# EAGLE design version10_25 (EAGLE 7.1.0)
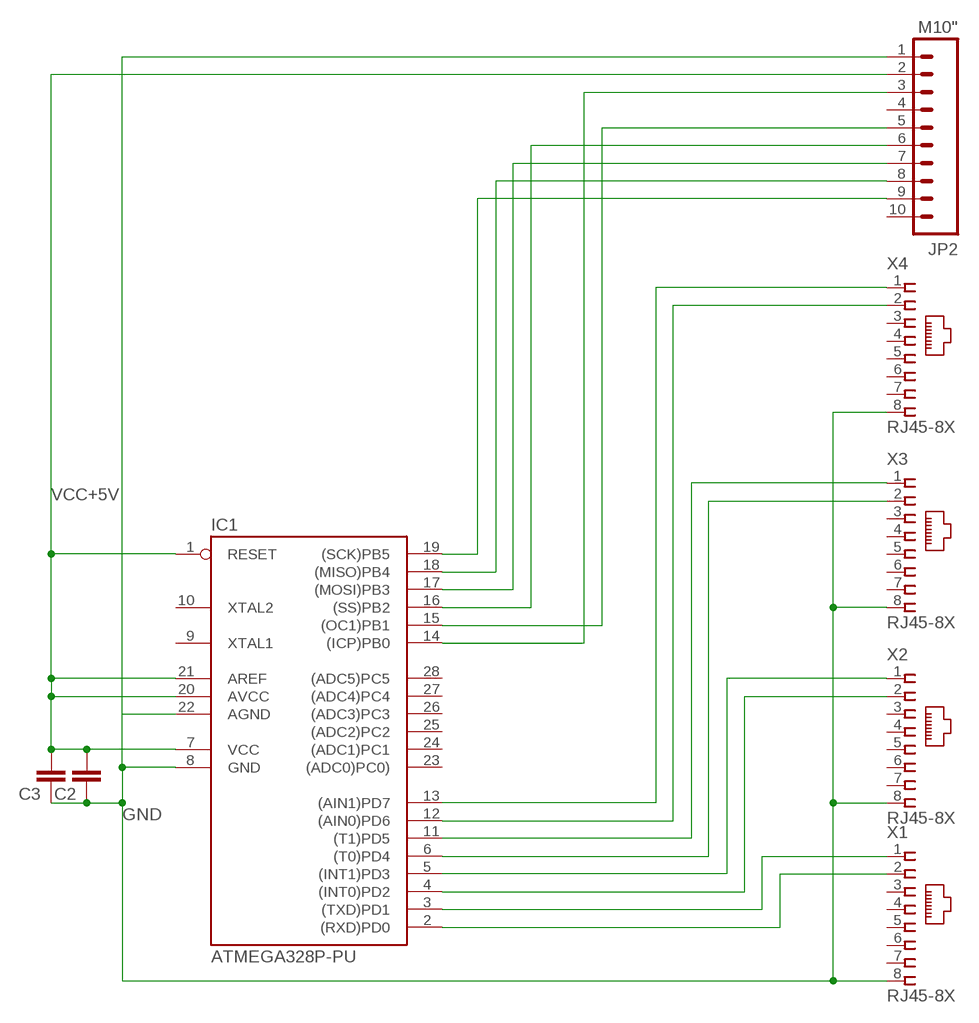
[diagram p0: schematic, sheet 1]

## Parts
C2  CAP1206  [1206]
C3  CAP1206  [1206]
IC1  ATMEGA328P-PU  [DIL28-3]
JP2  M10"  [1X10]
X1  RJ45-8X  [RJ45-NO-SHIELD]
X2  RJ45-8X  [RJ45-NO-SHIELD]
X3  RJ45-8X  [RJ45-NO-SHIELD]
X4  RJ45-8X  [RJ45-NO-SHIELD]

## Nets
GND: C2.1 C3.1 IC1.8(GND) IC1.22(AGND) JP2.1 X1.8 X2.8 X3.8 X4.8
N$1: IC1.19((SCK)PB5) JP2.9
N$2: IC1.18((MISO)PB4) JP2.8
N$3: IC1.15((OC1)PB1) JP2.5
N$4: IC1.17((MOSI)PB3) JP2.7
N$5: IC1.16((SS)PB2) JP2.6
N$6: IC1.14((ICP)PB0) JP2.3
N$7: IC1.2((RXD)PD0) X1.2
N$8: IC1.3((TXD)PD1) X1.1
N$9: IC1.4((INT0)PD2) X2.2
N$10: IC1.5((INT1)PD3) X2.1
N$11: IC1.6((T0)PD4) X3.2
N$12: IC1.11((T1)PD5) X3.1
N$13: IC1.12((AIN0)PD6) X4.2
N$14: IC1.13((AIN1)PD7) X4.1
VCC+5V: C2.2 C3.2 IC1.1(RESET) IC1.7(VCC) IC1.20(AVCC) IC1.21(AREF) JP2.2
Unconnected: IC1.9(XTAL1) IC1.10(XTAL2) IC1.23((ADC0)PC0)) IC1.24((ADC1)PC1) IC1.25((ADC2)PC2) IC1.26((ADC3)PC3) IC1.27((ADC4)PC4) IC1.28((ADC5)PC5) JP2.4 JP2.10 X1.3 X1.4 X1.5 X1.6 X1.7 X2.3 X2.4 X2.5 X2.6 X2.7 X3.3 X3.4 X3.5 X3.6 X3.7 X4.3 X4.4 X4.5 X4.6 X4.7

## Library data of the parts
C2 C3 = SparkFun-Capacitors:CAP: Capacitor Standard 0603 ceramic capacitor, and 0.1" leaded capacitor.
IC1 = SmartPrj:ATMEGA328P-: MICROCONTROLLER 4 Kbytes FLASH 128 bytes SRAM 256 bytes EEPROM UART 6-channel 10 bit ADC
JP2 = SparkFun-Connectors:M10: Header 10 Standard 10-pin 0.1" header. Use with straight break away headers (SKU : PRT-00116), right angle break away headers (PRT-00553), swiss pins (PRT-00743), machine pins (PRT-00117), and female headers (PRT-00115).
X1-X4 = con-tycoelectronics:RJ45: CORCOM Modular RJ Jacks No Shield Source: www.tycoelectronics.com .. ENG_DS_1654001_1099_RJ_L_0507.pdf; MPN: RJ45-8X; OC_FARNELL: unknown; OC_NEWARK: 16R6101

## Board
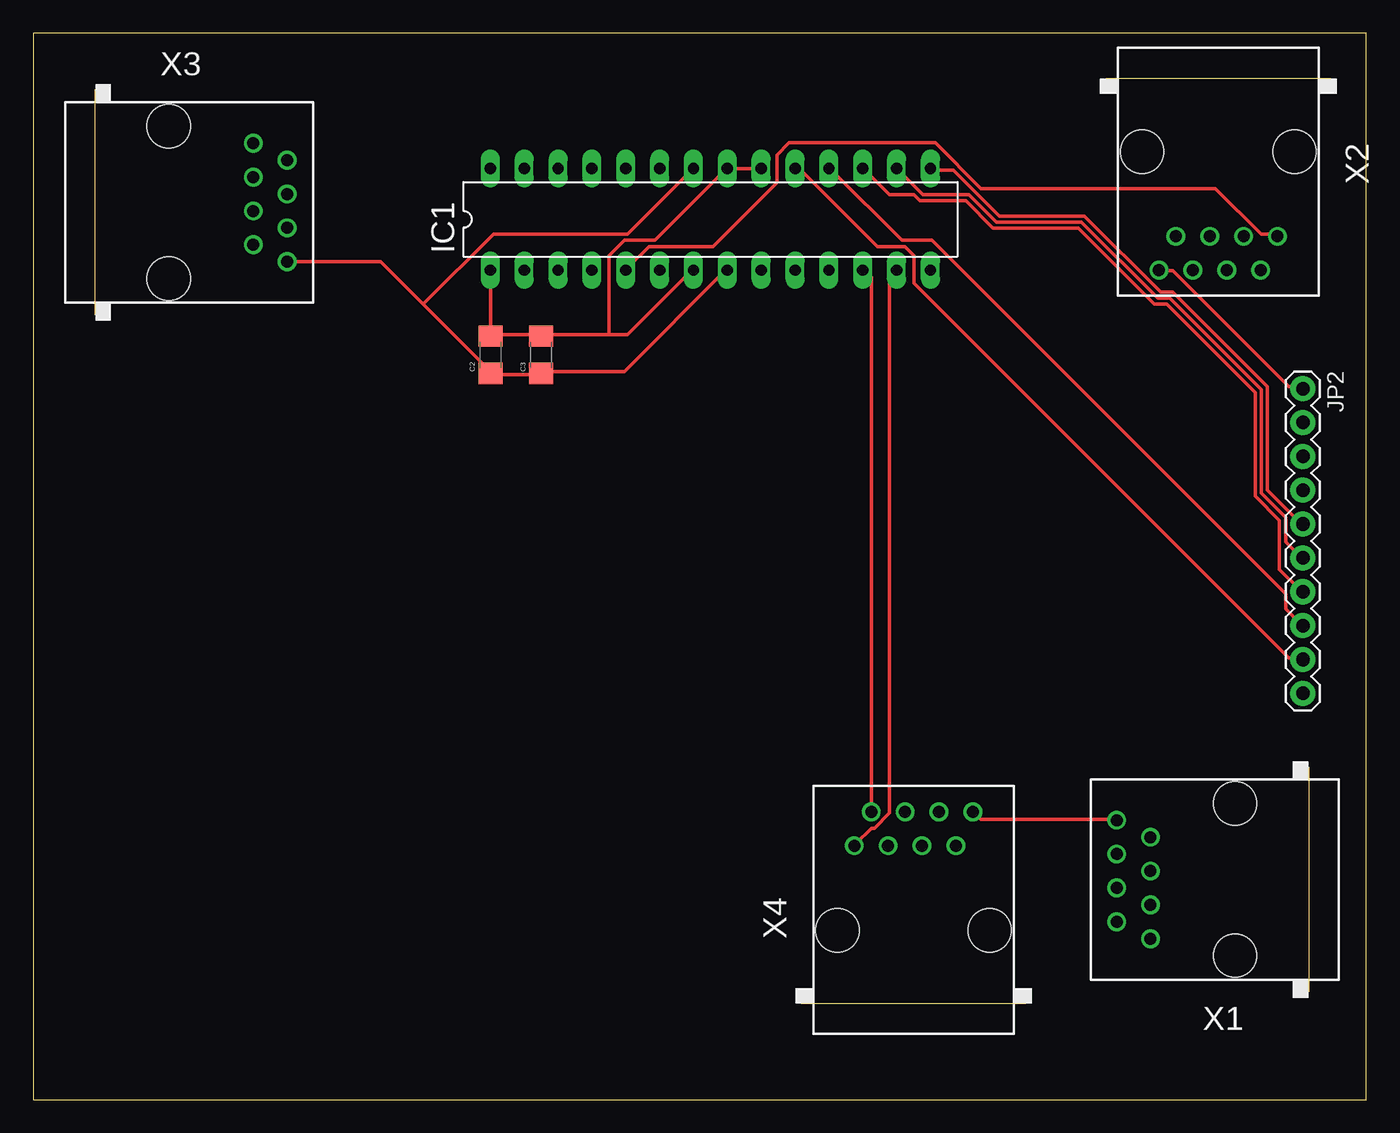
[diagram p1: board, top side]
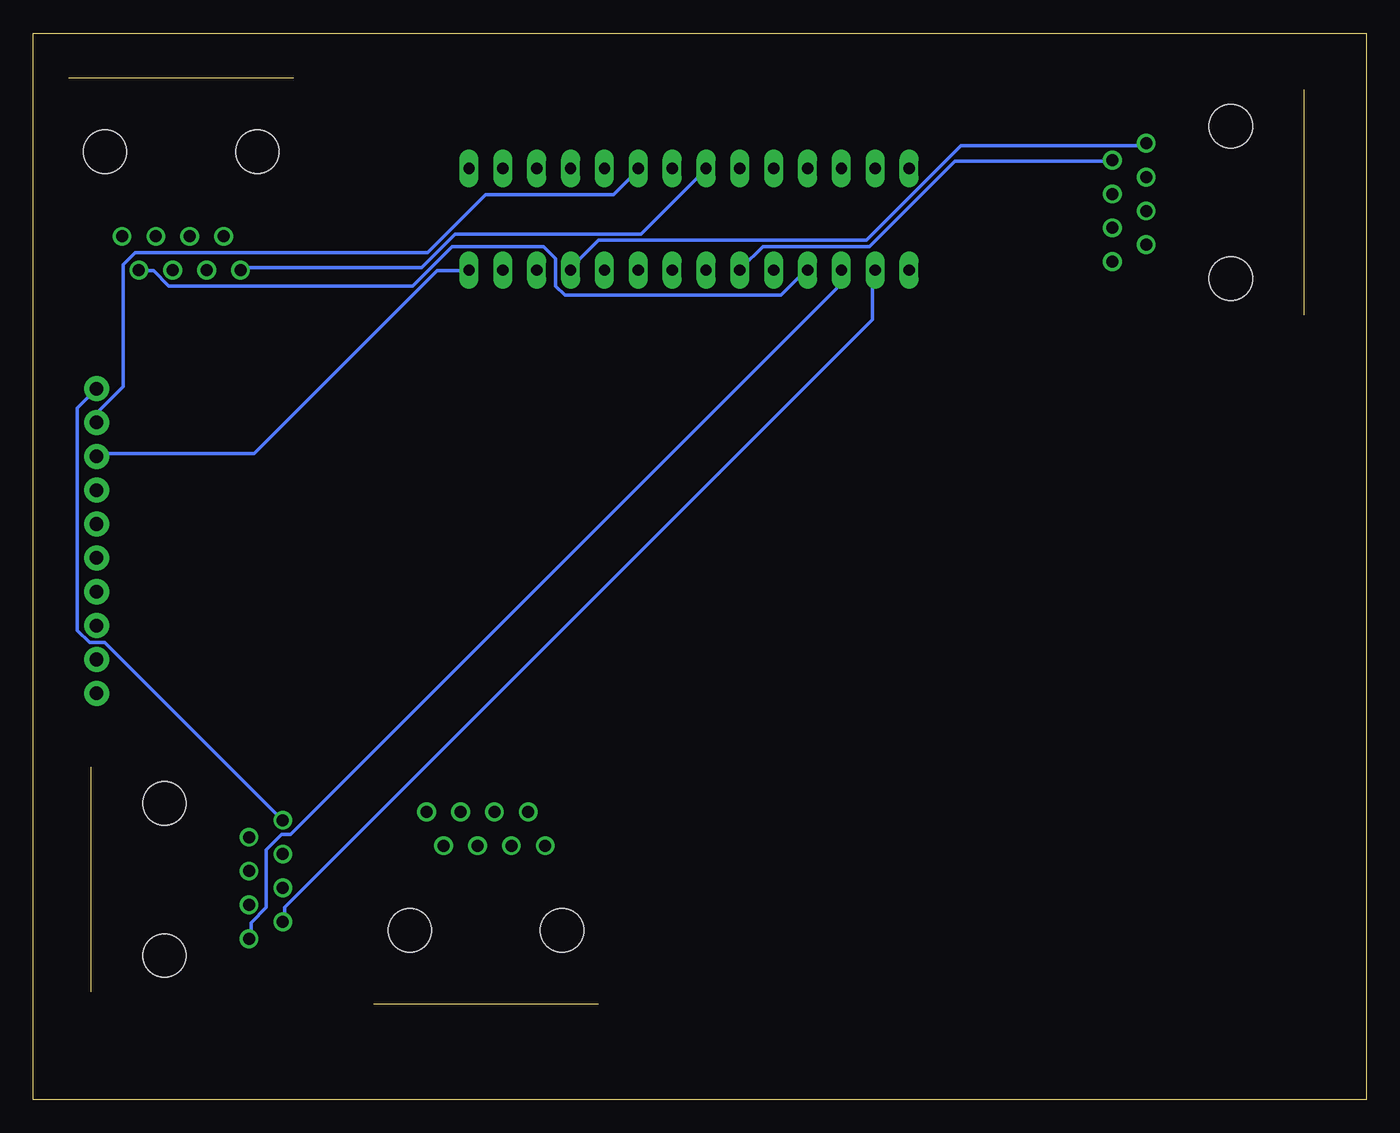
[diagram p2: board, bottom side, seen from below]

Size 100 x 80 mm. Coordinates in mm from the lower left corner, seen from the top.
Outline: 0,0 100,0 100,80 0,80 0,0
Copper layers (1*16): Top 0.035mm / dielectric 1.5mm / Bottom 0.035mm
Design rules "default": minimum track width 10mil, minimum drill 24mil, track to track 8mil, track to pad 8mil, pad to pad 8mil, via to via 8mil, smd to smd 8mil, copper to edge 40mil, drill to drill 8mil, minimum pad ring 10mil, minimum via ring 8mil, stop-mask expansion 4mil, vias tented up to drill 0mil, thermal gap 10mil

### Footprints (pad centres in the part's own frame; a part is rotated, then mirrored left to right if it is on the bottom)
1206 = smd 1.6 x 1.8: 1 -1.4,0; 2 1.4,0
DIL28-3 = drill 0.85 pad 1.422 long: 1 -16.51,-3.81; 2 -13.97,-3.81; 3 -11.43,-3.81; 4 -8.89,-3.81; 5 -6.35,-3.81; 6 -3.81,-3.81; 7 -1.27,-3.81; 8 1.27,-3.81; 9 3.81,-3.81; 10 6.35,-3.81; 11 8.89,-3.81; 12 11.43,-3.81; 13 13.97,-3.81; 14 16.51,-3.81; 15 16.51,3.81; 16 13.97,3.81; 17 11.43,3.81; 18 8.89,3.81; 19 6.35,3.81; 20 3.81,3.81; 21 1.27,3.81; 22 -1.27,3.81; 23 -3.81,3.81; 24 -6.35,3.81; 25 -8.89,3.81; 26 -11.43,3.81; 27 -13.97,3.81; 28 -16.51,3.81
1X10 = drill 1.016 pad 1.88: 1 0,0; 2 2.54,0; 3 5.08,0; 4 7.62,0; 5 10.16,0; 6 12.7,0; 7 15.24,0; 8 17.78,0; 9 20.32,0; 10 22.86,0
RJ45-NO-SHIELD = drill 0.9 pad 1.4: 1 -4.445,6.35; 2 -3.175,8.89; 3 -1.905,6.35; 4 -0.635,8.89; 5 0.635,6.35; 6 1.905,8.89; 7 3.175,6.35; 8 4.445,8.89 | hole 3.251: -5.715,0; 5.715,0

### Placement (x,y rotation side)
C2  34.29,55.88 90 top
C3  38.1,55.88 90 top
IC1  50.8,66.04 0 top
JP2  95.25,53.34 270 top
X1  90.17,16.51 90 top
X2  88.9,71.12 180 top
X3  10.16,67.31 270 top
X4  66.04,12.7 0 top

### Tracks (layer width: path | path; a pad name or v marks a point on that pad's centre or on a via)
GND
  Top 0.254: X3.8 26.06,62.87 29.26,59.66 | 29.26,59.66 34.29,54.63 C2.1 34.29,54.41 37.95,54.41 C3.1 38.18,54.63 44.35,54.63 51.89,62.18 IC1.8 | 29.26,59.66 34.52,64.92 44.58,64.92 49.38,69.72 IC1.22 | X1.8 81.15,21.03 71.09,21.03 70.64,21.49 X4.8 | X2.8 84.58,62.18 85.5,62.18 94.18,53.49 95.1,53.49 JP2.1
  Bottom 0.254: JP2.1 96.7,51.89 96.7,35.2 95.78,34.29 94.64,34.29 81.38,21.03 X1.8 | IC1.22 49.61,69.72 54.41,64.92 68.35,64.92 70.87,62.41 84.35,62.41 X2.8
N$1
  Top 0.254: IC1.19 57.15,69.72 57.61,69.72 63.32,64.01 65.38,64.01 66.06,63.32 66.06,61.27 94.18,33.15 95.1,33.15 JP2.9
N$2
  Top 0.254: IC1.18 59.89,69.72 65.15,64.47 67.44,64.47 93.95,37.95 93.95,36.8 95.1,35.66 JP2.8
N$3
  Top 0.254: JP2.5 95.1,43.2 92.58,45.72 92.58,53.49 85.5,60.58 84.58,60.58 78.87,66.29 72.47,66.29 69.04,69.72 67.44,69.72 IC1.15
N$4
  Top 0.254: IC1.17 62.41,69.72 64.24,67.89 66.06,67.89 66.52,67.44 69.95,67.44 72.01,65.38 78.41,65.38 84.12,59.66 85.04,59.66 91.67,53.03 91.67,45.26 93.5,43.43 93.5,39.78 95.1,38.18 JP2.7
N$5
  Top 0.254: IC1.16 64.92,69.72 66.75,67.89 70.18,67.89 72.24,65.84 78.64,65.84 84.35,60.12 85.27,60.12 92.13,53.26 92.13,45.49 93.95,43.66 93.95,41.83 95.1,40.69 JP2.6
N$6
  Bottom 0.254: IC1.14 67.44,62.18 69.72,62.18 83.44,48.46 95.1,48.46 JP2.3
N$7
  Bottom 0.254: X1.2 81.15,13.49 81.15,14.4 37.03,58.52 37.03,62.18 IC1.2
N$8
  Bottom 0.254: X1.1 83.67,12.12 83.67,13.26 82.53,14.4 82.53,18.75 81.38,19.89 80.7,19.89 39.55,61.04 39.55,62.18 IC1.3
N$9
  Bottom 0.254: X2.2 91.9,62.18 90.98,62.18 89.84,61.04 71.55,61.04 68.58,64.01 61.72,64.01 60.81,63.09 60.81,61.04 60.12,60.35 43.89,60.35 42.06,62.18 IC1.4
N$10
  Top 0.254: X2.1 93.27,64.92 92.13,64.92 88.7,68.35 71.09,68.35 67.67,71.78 56.69,71.78 55.78,70.87 55.78,68.81 50.98,64.01 46.18,64.01 44.58,62.41 IC1.5
N$11
  Bottom 0.254: X3.2 19.2,70.41 30.86,70.41 37.26,64.01 45.26,64.01 46.86,62.41 IC1.6
N$12
  Bottom 0.254: X3.1 16.69,71.55 30.4,71.55 37.49,64.47 57.61,64.47 59.66,62.41 IC1.11
N$13
  Top 0.254: X4.2 62.87,61.72 62.41,62.18 IC1.12
N$14
  Top 0.254: X4.1 61.72,19.2 62.87,20.34 63.09,20.34 64.24,21.49 64.24,61.72 64.69,62.18 IC1.13
VCC+5V
  Top 0.254: IC1.20 IC1.21 51.89,69.72 46.63,64.47 44.35,64.47 43.2,63.32 43.2,57.38 | 95.1,50.75 JP2.2 | 34.29,57.38 37.95,57.38 C3.2 38.18,57.38 43.2,57.38 | 34.29,57.38 IC1.1 | 34.29,57.38 C2.2 | 43.2,57.38 44.58,57.38 49.38,62.18 IC1.7
  Bottom 0.254: JP2.2 95.1,50.98 95.1,51.66 93.27,53.49 93.27,62.64 92.35,63.55 70.41,63.55 66.06,67.89 56.46,67.89 54.63,69.72 IC1.20